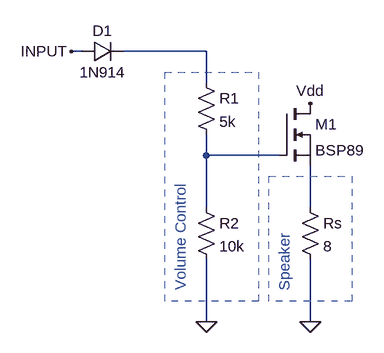
[diagram p0: schematic Draft10.asc]
Draft10.asc, the LTspice schematic file:
Version 4
SHEET 1 880 680
WIRE -64 32 -80 32
WIRE 128 32 0 32
WIRE 128 80 128 32
WIRE 128 192 128 160
WIRE 240 192 128 192
WIRE 128 272 128 192
WIRE 288 272 288 208
WIRE 128 448 128 352
WIRE 288 448 288 352
FLAG 128 448 0
FLAG 288 448 0
FLAG 288 112 Vdd
FLAG -80 32 INPUT
SYMBOL diode -64 48 R270
WINDOW 0 32 32 VTop 2
WINDOW 3 0 32 VBottom 2
SYMATTR InstName D1
SYMATTR Value 1N914
SYMBOL res 112 64 R0
SYMATTR InstName R1
SYMATTR Value 5k
SYMBOL res 112 256 R0
SYMATTR InstName R2
SYMATTR Value 10k
SYMBOL res 272 256 R0
SYMATTR InstName Rs
SYMATTR Value 8
SYMBOL nmos 240 112 R0
SYMATTR InstName M1
SYMATTR Value BSP89
TEXT 248 400 VLeft 2 ;Speaker
TEXT 88 400 VLeft 2 ;Volume Control
RECTANGLE Normal 208 416 64 64 2
RECTANGLE Normal 352 416 224 224 2

The netlist it stands for:
* Draft10.asc
D1 INPUT N001 1N914
R1 N001 N002 5k
R2 N002 0 10k
Rs N003 0 8
M1 Vdd N002 N003 N003 BSP89
.model D D
.lib standard.dio
.model NMOS NMOS
.model PMOS PMOS
.lib standard.mos
* Speaker
* Volume Control
.backanno
.end